# EAGLE design snullv2 (EAGLE 7.2.0)
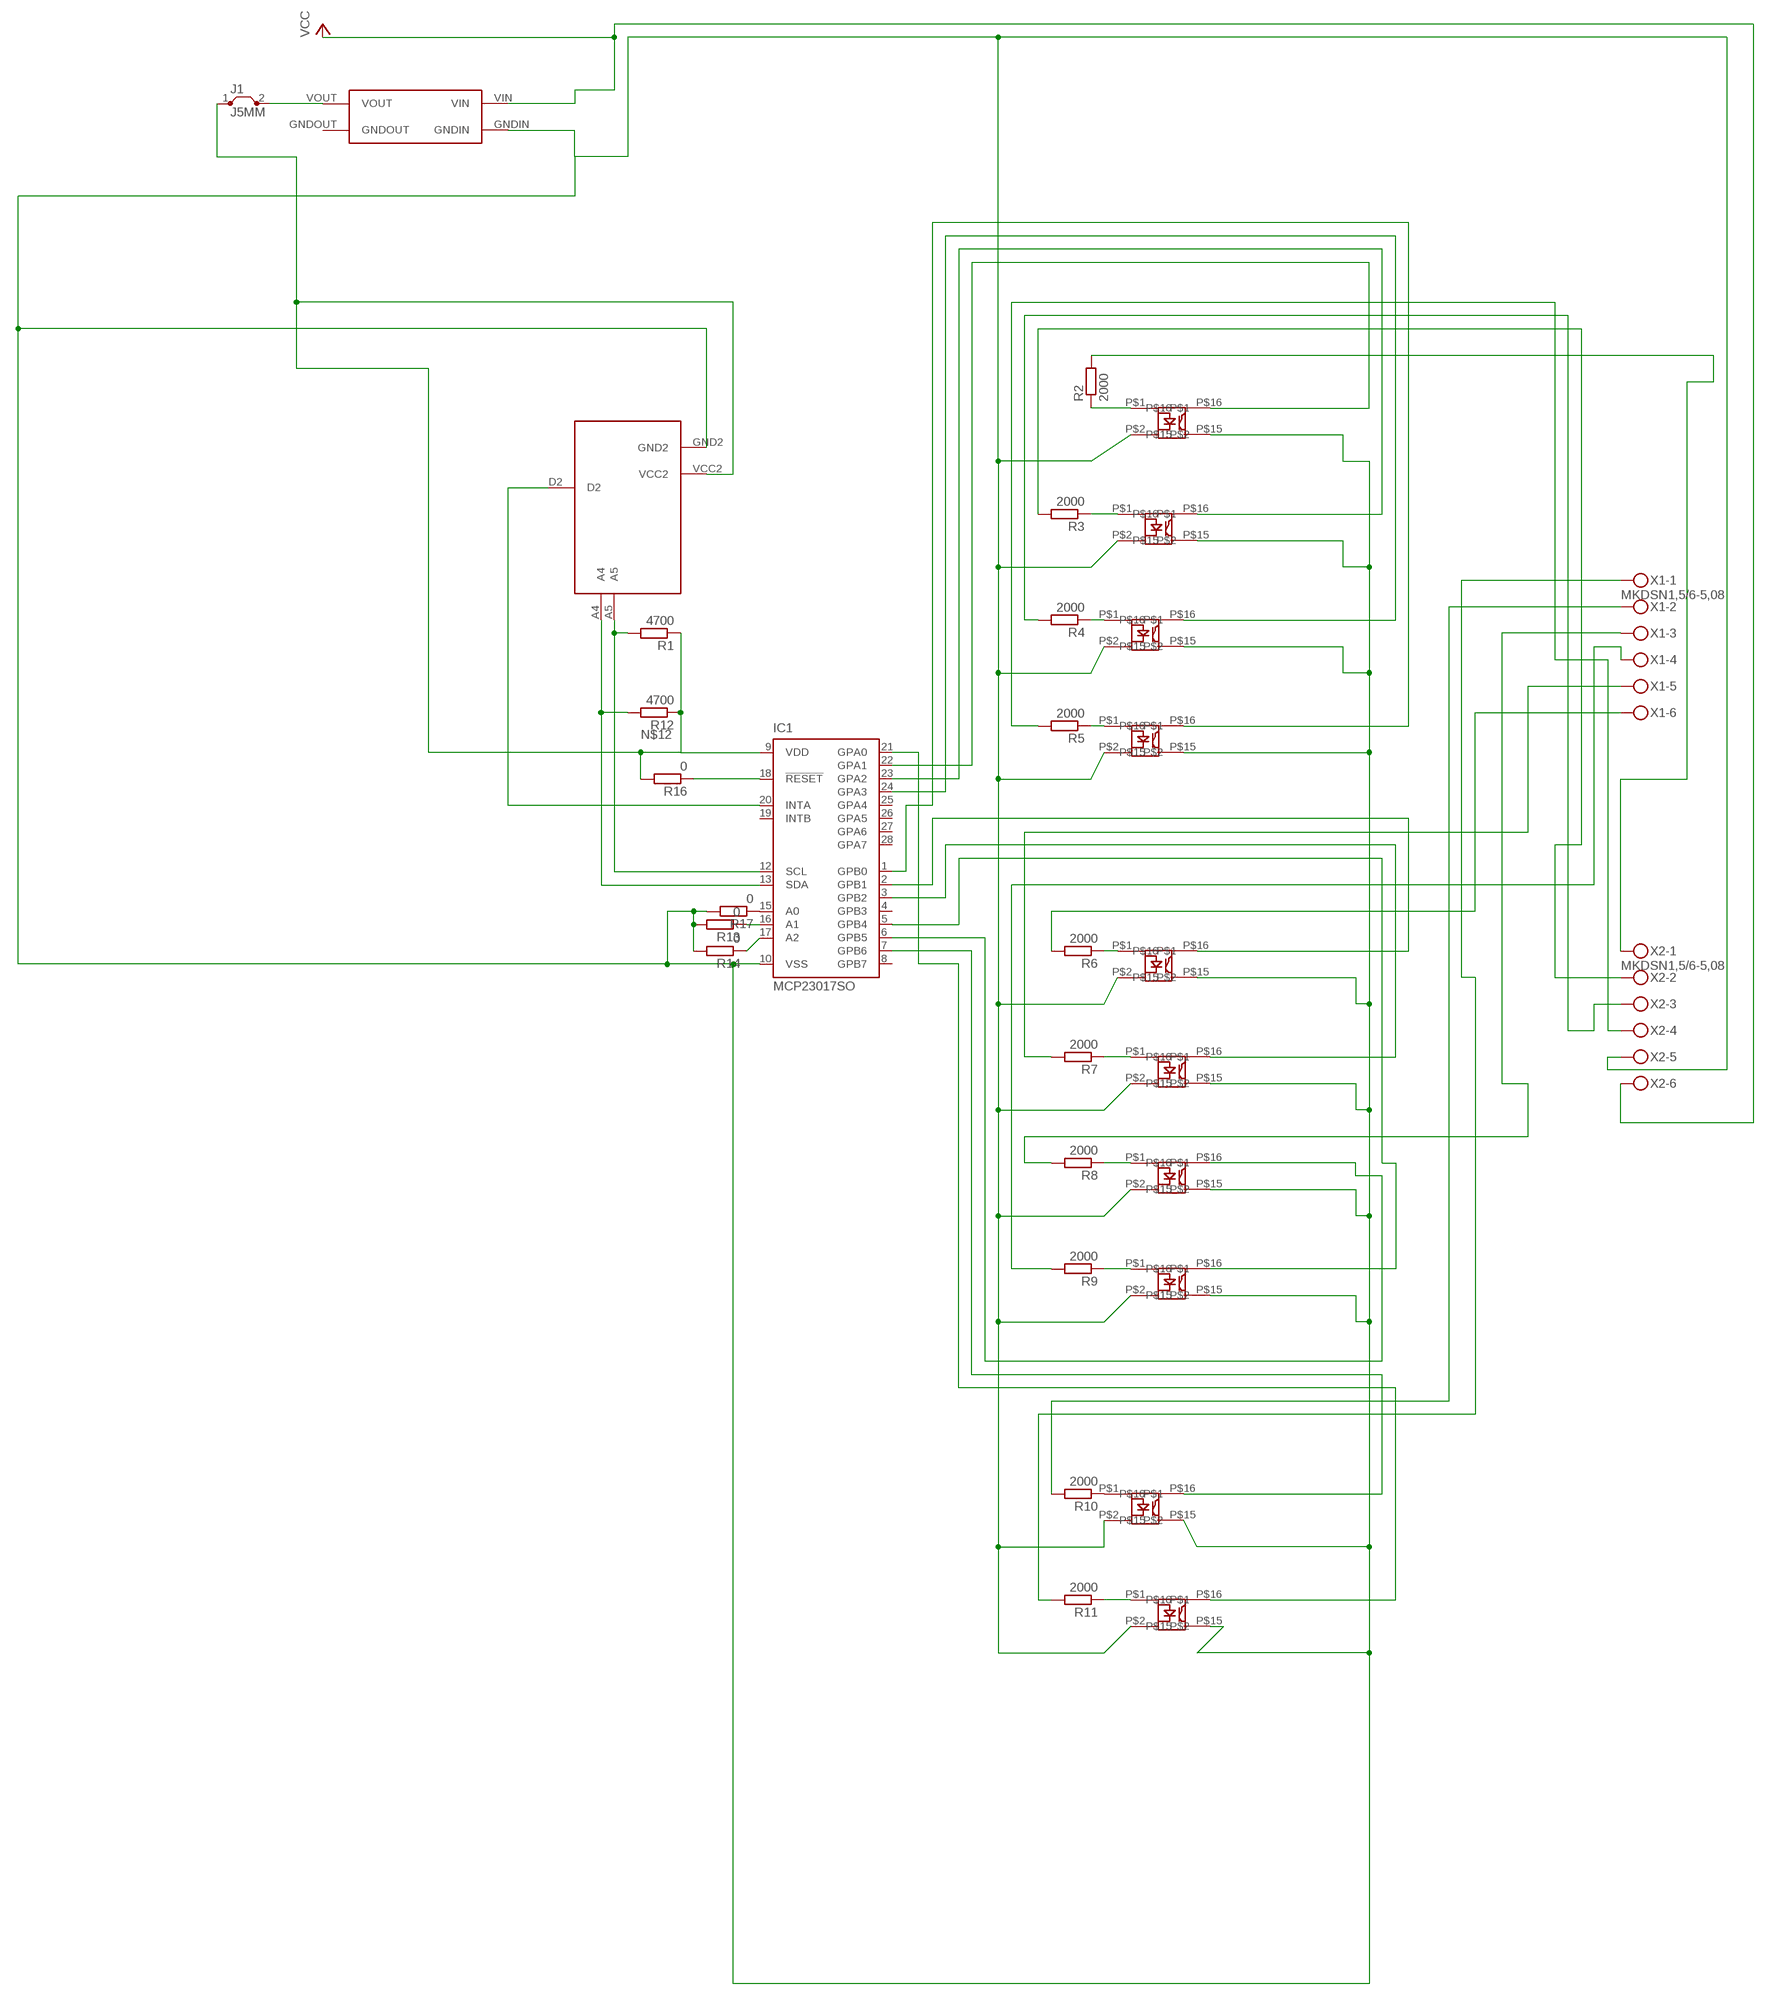
[diagram p0: schematic, sheet 1]

## Parts
IC1  MCP23017SO  [SO28W]
J1  J5MM  [05]
R1  4700  R-EU_R0805  [R0805]
R2  2000  R-EU_R0805  [R0805]
R3  2000  R-EU_R0805  [R0805]
R4  2000  R-EU_R0805  [R0805]
R5  2000  R-EU_R0805  [R0805]
R6  2000  R-EU_R0805  [R0805]
R7  2000  R-EU_R0805  [R0805]
R8  2000  R-EU_R0805  [R0805]
R9  2000  R-EU_R0805  [R0805]
R10  2000  R-EU_R0805  [R0805]
R11  2000  R-EU_R0805  [R0805]
R12  4700  R-EU_R0805  [R0805]
R13  0  R-EU_R0805  [R0805]
R14  0  R-EU_R0805  [R0805]
R16  0  R-EU_R0805  [R0805]
R17  0  R-EU_R0805  [R0805]
U$1  ARDUINOPROMINIREDUCED  [ARDUINOPROMINIREDUCED]
U$3  OPTO1CHAN  [OPTO1CHAN]
U$4  OPTO1CHAN  [OPTO1CHAN]
U$5  VREGMODULE  [VREGMODULE]
U$6  OPTO1CHAN  [OPTO1CHAN]
U$7  OPTO1CHAN  [OPTO1CHAN]
U$8  OPTO1CHAN  [OPTO1CHAN]
U$9  OPTO1CHAN  [OPTO1CHAN]
U$10  OPTO1CHAN  [OPTO1CHAN]
U$11  OPTO1CHAN  [OPTO1CHAN]
U$12  OPTO1CHAN  [OPTO1CHAN]
U$13  OPTO1CHAN  [OPTO1CHAN]
X1  MKDSN1,5/6-5,08  [MKDSN1,5/6-5,08]
X2  MKDSN1,5/6-5,08  [MKDSN1,5/6-5,08]

## Nets
N$1: R11.1 U$13.P$1
N$2: R6.1 U$8.P$1
N$3: R7.1 U$9.P$1
N$4: R8.1 U$10.P$1
N$5: R9.1 U$11.P$1
N$6: R10.1 U$12.P$1
N$7: R5.1 U$7.P$1
N$8: R4.1 U$6.P$1
N$9: R3.1 U$4.P$1
N$10: R2.1 U$3.P$1
N$11: IC1.13(SDA) R12.2 U$1.A4
N$12: IC1.9(VDD) J1.1 R1.1 R12.1 R16.2 U$1.VCC2
N$13: IC1.17(A2) R14.1
N$14: IC1.18(!RESET) R16.1
N$15: IC1.20(INTA) U$1.D2
N$16: R6.2 X1.6
N$17: R9.2 X1.4
N$18: R8.2 X1.3
N$19: J1.2 U$5.VOUT
N$20: IC1.15(A0) R17.1
N$21: IC1.16(A1) R13.1
N$22: IC1.12(SCL) R1.2 U$1.A5
N$25: R3.2 X2.2
N$26: R4.2 X2.3
N$27: R5.2 X2.4
N$28: R7.2 X1.5
N$29: R2.2 X2.1
N$31: R10.2 X1.2
N$32: R11.2 X1.1
N$34: IC1.22(GPA1) U$3.P$16
N$35: IC1.23(GPA2) U$4.P$16
N$36: IC1.24(GPA3) U$6.P$16
N$37: IC1.1(GPB0) U$7.P$16
N$38: IC1.2(GPB1) U$8.P$16
N$39: IC1.3(GPB2) U$9.P$16
N$40: IC1.5(GPB4) U$11.P$16
N$41: IC1.6(GPB5) U$10.P$16
N$42: IC1.7(GPB6) U$12.P$16
N$43: IC1.21(GPA0) U$13.P$16
VCC: U$5.VIN X2.6
VDD: IC1.10(VSS) R13.2 R14.2 R17.2 U$1.GND2 U$3.P$2 U$3.P$15 U$4.P$2 U$4.P$15 U$5.GNDIN U$6.P$2 U$6.P$15 U$7.P$2 U$7.P$15 U$8.P$2 U$8.P$15 U$9.P$2 U$9.P$15 U$10.P$2 U$10.P$15 U$11.P$2 U$11.P$15 U$12.P$2 U$12.P$15 U$13.P$2 U$13.P$15 X2.5
Unconnected: IC1.4(GPB3) IC1.8(GPB7) IC1.19(INTB) IC1.25(GPA4) IC1.26(GPA5) IC1.27(GPA6) IC1.28(GPA7) U$5.GNDOUT

## Library data of the parts
IC1 = microchip:MCP23017: http://ww1.microchip.com/downloads/en/DeviceDoc/21952a.pdf Source: http://ww1.microchip.com/downloads/en/DeviceDoc/21952a.pdf; MF: MICROCHIP; MPN: MCP23017-E/SO; OC_FARNELL: 1332087; OC_NEWARK: 31K2958
J1 = jumper:J: Bridge
R1-R14 R16 R17 = resistor:R-EU_: RESISTOR, European symbol
U$1 = snulllib:ARDUINOPROMINIREDUCED
U$3 U$4 U$6-U$13 = snulllib:OPTO1CHAN
U$5 = snulllib:VREGMODULE
X1 X2 = con-phoenix-508:MKDSN1,5/6-5,08: MKDSN 1,5/ 6-5,08 Printklemme Nennstrom: 13,5 A Nennspannung: 250 V Rastermaß: 5,08 mm Polzahl: 6 Anschlussart: Schraubanschluss Montage: Löten Anschlussrichtung Leiter/Platine: 0 ° Artikelnummer: 1729160 Source: http://eshop.phoenixcontact.com .. 1729160.pdf

## Board
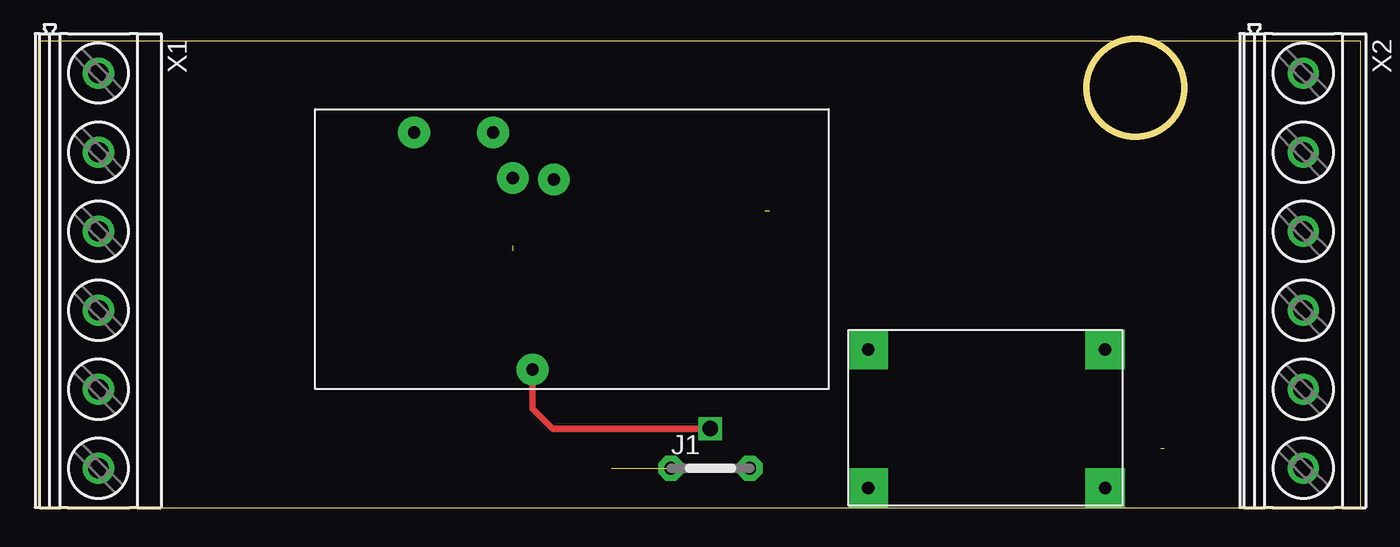
[diagram p1: board, top side]
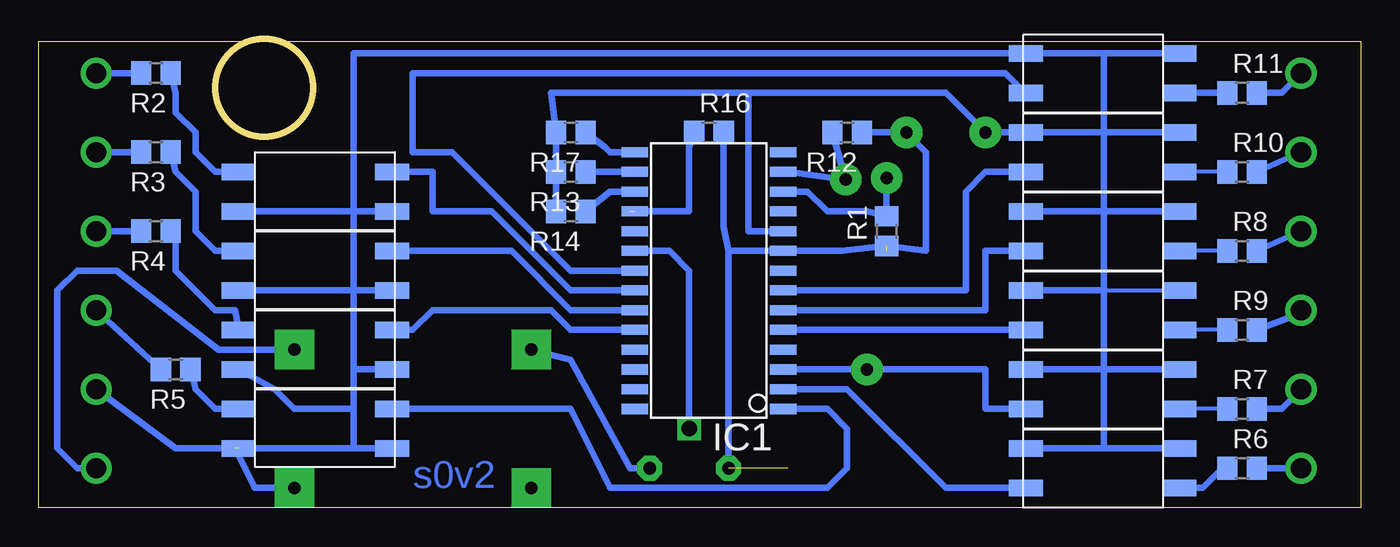
[diagram p2: board, bottom side, seen from below]

Size 85 x 30.14 mm. Coordinates in mm from the lower left corner, seen from the top.
Outline: 0,0 85,0 85,30 0,30 0,0
Outline: circle at 70.5,27 radius 3.14
Copper layers (1*16): Top 0.035mm / dielectric 1.5mm / Bottom 0.035mm
Design rules "default": minimum track width 10mil, minimum drill 24mil, track to track 8mil, track to pad 8mil, pad to pad 8mil, via to via 8mil, smd to smd 8mil, copper to edge 40mil, drill to drill 8mil, minimum pad ring 10mil, minimum via ring 8mil, stop-mask expansion 4mil, vias tented up to drill 0mil, thermal gap 10mil

### Footprints (pad centres in the part's own frame; a part is rotated, then mirrored left to right if it is on the bottom)
SO28W = smd 0.65 x 1.7: 1 -7.62,-4.78; 2 -6.35,-4.78; 3 -5.08,-4.78; 4 -3.81,-4.78; 5 -2.54,-4.78; 6 -1.27,-4.78; 7 0,-4.78; 8 1.27,-4.78; 9 2.54,-4.78; 10 3.81,-4.78; 11 5.08,-4.78; 12 6.35,-4.78; 13 7.62,-4.78; 14 8.89,-4.78; 15 8.89,4.78; 16 7.62,4.78; 17 6.35,4.78; 18 5.08,4.78; 19 3.81,4.78; 20 2.54,4.78; 21 1.27,4.78; 22 0,4.78; 23 -1.27,4.78; 24 -2.54,4.78; 25 -3.81,4.78; 26 -5.08,4.78; 27 -6.35,4.78; 28 -7.62,4.78
05 = drill 0.813 pad 1.6 octagon: 1 -2.54,0; 2 2.54,0
R0805 = smd 1.3 x 1.5: 1 -0.95,0; 2 0.95,0
ARDUINOPROMINIREDUCED = drill 0.8 pad 2.032: A4 13.47,-15.34; A5 13.57,-12.7; D2 1.27,-13.97; GND2 16.51,-6.35; VCC2 16.51,-11.43
OPTO1CHAN = smd 2.184 x 1.067: P$1 -1.035,-1.27; P$2 -1.035,-3.81; P$15 8.825,-3.81; P$16 8.825,-1.27
VREGMODULE = drill 0.8 pad 2.54 square: GNDIN 16.51,-10.16; GNDOUT 1.27,-10.16; VIN 16.51,-1.27; VOUT 1.27,-1.27
MKDSN1,5/6-5,08 = drill 1.3 pad 2: 1 -12.7,0.025; 2 -7.62,0.025; 3 -2.54,0.025; 4 2.54,0.025; 5 7.62,0.025; 6 12.7,0.025

### Placement (x,y rotation side)
IC1  41.91,13.97 90 bottom
J1  43.18,2.54 0 top
R1  30.48,17.78 90 bottom
R2  77.47,27.94 180 bottom
R3  77.47,22.86 180 bottom
R4  77.47,17.78 180 bottom
R5  76.2,8.89 180 bottom
R6  7.62,2.54 0 bottom
R7  7.62,6.35 0 bottom
R8  7.62,16.51 0 bottom
R9  7.62,11.43 0 bottom
R10  7.62,21.59 0 bottom
R11  7.62,26.67 0 bottom
R12  33.02,24.13 180 bottom
R13  50.8,21.59 180 bottom
R14  50.8,19.05 180 bottom
R16  41.91,24.13 0 bottom
R17  50.8,24.13 180 bottom
U$1  17.78,7.62 90 top
U$3  71.12,22.86 0 bottom
U$4  71.12,17.78 0 bottom
U$5  52.07,11.43 0 top
U$6  71.12,12.7 0 bottom
U$7  71.12,7.62 0 bottom
U$8  12.7,0 180 bottom
U$9  12.7,5.08 180 bottom
U$10  12.7,15.24 180 bottom
U$11  12.7,10.16 180 bottom
U$12  12.7,20.32 180 bottom
U$13  12.7,25.4 180 bottom
X1  3.81,15.24 270 top
X2  81.28,15.24 270 top

### Tracks (layer width: path | path; a pad name or v marks a point on that pad's centre or on a via)
N$1
  Bottom 0.406: R11.1 U$13.P$1
N$2
  Bottom 0.406: U$8.P$1 10.16,1.27 8.89,2.54 R6.1
N$3
  Bottom 0.254: R7.1 U$9.P$1
N$4
  Bottom 0.254: R8.1 U$10.P$1
N$5
  Bottom 0.254: R9.1 U$11.P$1
N$6
  Bottom 0.254: R10.1 U$12.P$1
N$7
  Bottom 0.406: U$7.P$1 73.66,6.35 74.93,7.62 R5.1
N$8
  Bottom 0.406: U$6.P$1 72.39,12.7 73.66,12.7 76.2,15.24 76.2,17.78 R4.1
N$9
  Bottom 0.406: U$4.P$1 73.66,16.51 74.93,17.78 74.93,20.32 76.2,21.59 R3.1
N$10
  Bottom 0.406: U$3.P$1 73.66,21.59 74.93,22.86 74.93,24.13 76.2,25.4 76.2,26.67 R2.1
N$11
  Bottom 0.406: IC1.13 36.83,21.59 U$1.A4 R12.2
N$12  (2 unrouted)
  Bottom 0.406: R16.2 40.96,18.1 40.64,16.51 | 40.64,16.51 IC1.9 33.34,16.51 R1.1 27.94,16.51 27.94,22.86 U$1.VCC2 R12.1 | J1.1 40.64,16.51
N$13
  Bottom 0.406: R14.1 48.26,20.32 IC1.17
N$14  (1 unrouted)
  Bottom 0.406: 46.99,19.05 43.18,19.05 43.18,23.18 R16.1
N$15  (via drill 1 pad 0.1)
  Top 0.406: v43.18,5.08 33.02,5.08 31.75,6.35 U$1.D2
  Bottom 0.406: v43.18,5.08 43.18,15.24 44.45,16.51 IC1.20
N$16
  Bottom 0.406: R6.2 X1.6
N$17
  Bottom 0.406: R9.2 4.16,12.38 X1.4
N$18
  Bottom 0.406: X1.3 R8.2
N$19
  Bottom 0.406: U$5.VOUT 50.8,9.51 46.99,2.54 J1.2
N$20
  Bottom 0.406: R17.1 48.58,23.18 48.26,22.86 IC1.15
N$21
  Bottom 0.406: R13.1 IC1.16
N$22
  Bottom 0.406: U$1.A5 R1.2 31.75,19.05 34.29,19.05 35.56,20.32 IC1.12
N$25
  Bottom 0.406: R3.2 X2.2
N$26
  Bottom 0.406: R4.2 X2.3
N$27
  Bottom 0.406: X2.4 R5.2
N$28
  Bottom 0.406: R7.2 5.08,6.35 3.83,7.59 X1.5
N$29
  Bottom 0.406: R2.2 X2.1
N$31
  Bottom 0.406: X1.2 R10.2
N$32
  Bottom 0.406: X1.1 3.83,27.91 5.08,26.67 R11.2
N$34
  Bottom 0.406: U$3.P$16 59.69,21.59 59.69,19.05 55.88,19.05 50.8,13.97 IC1.22
N$35
  Bottom 0.406: IC1.23 50.8,12.7 54.61,16.51 U$4.P$16
N$36
  Bottom 0.406: U$6.P$16 60.96,11.43 59.69,12.7 52.07,12.7 50.8,11.43 IC1.24
N$37
  Bottom 0.406: U$7.P$16 50.8,6.35 48.26,1.27 34.29,1.27 33.02,2.54 33.02,5.08 34.29,6.35 IC1.1
N$38
  Bottom 0.406: IC1.2 33.02,7.62 26.67,1.27 U$8.P$16
N$39
  Bottom 0.406: IC1.3 24.13,8.89 24.13,6.35 U$9.P$16
N$40
  Bottom 0.406: IC1.5 U$11.P$16
N$41
  Bottom 0.406: IC1.6 24.13,12.7 24.13,16.51 U$10.P$16
N$42
  Bottom 0.406: U$12.P$16 24.13,21.59 25.4,20.32 25.4,13.97 IC1.7
N$43
  Bottom 0.406: U$13.P$16 21.59,26.67 22.86,27.94 60.96,27.94 60.96,22.86 58.42,22.86 50.8,15.24 IC1.21
VCC
  Bottom 0.406: X2.6 82.55,2.54 83.82,3.81 83.82,13.97 82.55,15.24 80.01,15.24 73.44,10.16 U$5.VIN
VDD  (1 unrouted)
  Bottom 0.254: 16.51,13.97 U$11.P$2
  Bottom 0.406: U$8.P$2 16.51,3.81 | U$9.P$2 16.51,8.89 | U$10.P$2 16.51,19.05 | 16.51,24.13 U$12.P$15 U$1.GND2 26.67,26.67 39.37,26.67 | 16.51,24.13 U$12.P$2 | U$10.P$15 16.51,19.05 | 16.51,19.05 16.51,24.13 | U$11.P$15 16.51,13.97 | 16.51,13.97 16.51,19.05 | U$9.P$15 16.51,8.89 | 16.51,8.89 16.51,13.97 | U$8.P$15 16.51,3.81 | 16.51,3.81 16.51,8.89 | 64.77,19.05 U$3.P$2 | U$4.P$2 64.77,13.97 | 64.77,13.97 64.77,19.05 | 64.77,8.89 64.77,13.97 | U$7.P$2 64.77,3.81 | 64.77,3.81 64.77,6.35 | 64.77,6.35 64.77,8.89 | U$7.P$15 64.77,3.81 | U$6.P$15 64.77,8.89 | 64.77,13.97 U$4.P$15 | 64.77,19.05 U$3.P$15 | IC1.10 39.37,17.78 39.37,26.67 | U$13.P$2 16.51,29.21 | 16.51,29.21 16.51,24.13 | 16.51,29.21 U$13.P$15 64.77,29.21 64.77,19.05 | 39.37,26.67 52.07,26.67 R17.2 R13.2 R14.2 | U$5.GNDIN 71.12,1.27 72.39,3.81 76.2,3.81 X2.5 | U$6.P$2 69.85,7.62 68.58,6.35 64.77,6.35

### Text on the board
Bottom: s0v2